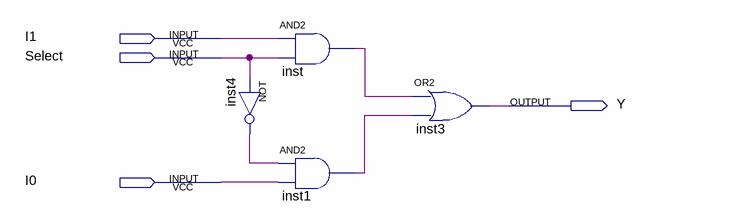
[diagram p0: schematic sheet]
// Quartus schematic Mux2_1.bdf as structural Verilog: 4 symbols, 4 pins
module Mux2_1 (
  input  I1,
  input  Select,
  input  I0,
  output Y
);

  wire inst1_out, inst4_out, inst_out;

  not inst4 (inst4_out, Select);
  and inst (inst_out, I1, Select);
  and inst1 (inst1_out, inst4_out, I0);
  or inst3 (Y, inst_out, inst1_out);
endmodule
